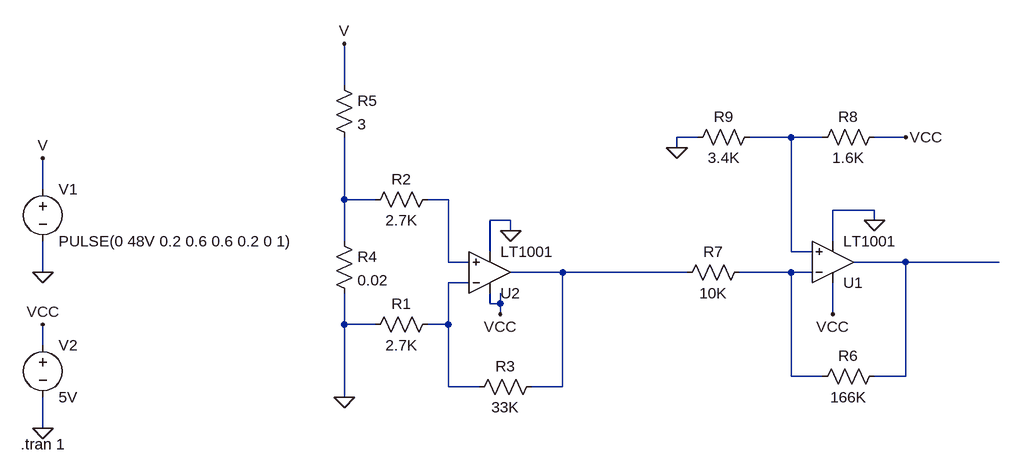
[diagram p0: schematic CurrentMeasurment.asc]
CurrentMeasurment.asc, the LTspice schematic file:
Version 4
SHEET 1 1984 680
WIRE 416 -128 416 -192
WIRE 960 -48 928 -48
WIRE 1104 -48 1040 -48
WIRE 1152 -48 1104 -48
WIRE 1280 -48 1232 -48
WIRE 928 -32 928 -48
WIRE -48 32 -48 -16
WIRE 416 48 416 -48
WIRE 464 48 416 48
WIRE 576 48 544 48
WIRE 1232 64 1168 64
WIRE 672 80 640 80
WIRE 1232 80 1232 64
WIRE 672 96 672 80
WIRE 416 112 416 48
WIRE 1168 112 1168 64
WIRE 640 128 640 80
WIRE 1104 128 1104 -48
WIRE 1136 128 1104 128
WIRE 576 144 576 48
WIRE 608 144 576 144
WIRE 1280 144 1200 144
WIRE 1424 144 1280 144
WIRE -48 160 -48 112
WIRE 752 160 672 160
WIRE 944 160 752 160
WIRE 1104 160 1024 160
WIRE 1136 160 1104 160
WIRE 608 176 576 176
WIRE 640 208 640 192
WIRE 656 208 656 192
WIRE 656 208 640 208
WIRE 656 224 656 208
WIRE 1168 224 1168 176
WIRE 416 240 416 192
WIRE 464 240 416 240
WIRE 576 240 576 176
WIRE 576 240 544 240
WIRE -48 272 -48 240
WIRE 1104 320 1104 160
WIRE 1152 320 1104 320
WIRE 1280 320 1280 144
WIRE 1280 320 1232 320
WIRE 576 336 576 240
WIRE 624 336 576 336
WIRE 752 336 752 160
WIRE 752 336 704 336
WIRE 416 352 416 240
WIRE -48 400 -48 352
FLAG -48 240 VCC
FLAG -48 400 0
FLAG -48 160 0
FLAG -48 -16 V
FLAG 416 352 0
FLAG 416 -192 V
FLAG 656 224 VCC
FLAG 672 96 0
FLAG 1168 224 VCC
FLAG 928 -32 0
FLAG 1280 -48 VCC
FLAG 1232 80 0
SYMBOL voltage -48 16 R0
WINDOW 123 0 0 Left 0
WINDOW 39 0 0 Left 0
SYMATTR InstName V1
SYMATTR Value PULSE(0 48V 0.2 0.6 0.6 0.2 0 1)
SYMBOL voltage -48 256 R0
WINDOW 123 0 0 Left 0
WINDOW 39 0 0 Left 0
SYMATTR InstName V2
SYMATTR Value 5V
SYMBOL res 560 32 R90
WINDOW 0 0 56 VBottom 2
WINDOW 3 32 56 VTop 2
SYMATTR InstName R2
SYMATTR Value 2.7K
SYMBOL res 560 224 R90
WINDOW 0 0 56 VBottom 2
WINDOW 3 32 56 VTop 2
SYMATTR InstName R1
SYMATTR Value 2.7K
SYMBOL res 720 320 R90
WINDOW 0 0 56 VBottom 2
WINDOW 3 32 56 VTop 2
SYMATTR InstName R3
SYMATTR Value 33K
SYMBOL res 400 96 R0
SYMATTR InstName R4
SYMATTR Value 0.02
SYMBOL res 400 -144 R0
SYMATTR InstName R5
SYMATTR Value 3
SYMBOL res 1248 304 R90
WINDOW 0 0 56 VBottom 2
WINDOW 3 32 56 VTop 2
SYMATTR InstName R6
SYMATTR Value 166K
SYMBOL res 1040 144 R90
WINDOW 0 0 56 VBottom 2
WINDOW 3 32 56 VTop 2
SYMATTR InstName R7
SYMATTR Value 10K
SYMBOL res 1248 -64 R90
WINDOW 0 0 56 VBottom 2
WINDOW 3 32 56 VTop 2
SYMATTR InstName R8
SYMATTR Value 1.6K
SYMBOL res 1056 -64 R90
WINDOW 0 0 56 VBottom 2
WINDOW 3 32 56 VTop 2
SYMATTR InstName R9
SYMATTR Value 3.4K
SYMBOL OpAmps\\LT1001 1168 208 M180
SYMATTR InstName U1
SYMBOL OpAmps\\LT1001 640 224 M180
SYMATTR InstName U2
TEXT -82 424 Left 2 !.tran 1

The netlist it stands for:
* CurrentMeasurment.asc
V1 V 0 PULSE(0 48V 0.2 0.6 0.6 0.2 0 1)
V2 VCC 0 5V
R2 N003 N002 2.7K
R1 N007 0 2.7K
R3 N005 N007 33K
R4 N002 0 0.02
R5 V N002 3
R6 N004 N006 166K
R7 N006 N005 10K
R8 VCC N001 1.6K
R9 N001 0 3.4K
XU1 N001 N006 VCC 0 N004 LT1001  ; pins In+ In- V+ V- OUT
XU2 N003 N007 VCC 0 N005 LT1001  ; pins In+ In- V+ V- OUT
.tran 1
.lib LTC.lib
.backanno
.end